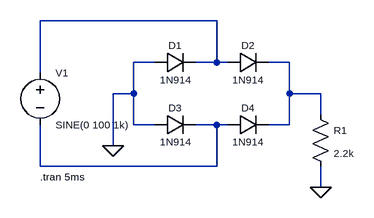
[diagram p0: schematic 1. Full Wave Rectifier.asc]
1. Full Wave Rectifier.asc, the LTspice schematic file:
Version 4
SHEET 1 880 680
WIRE 192 96 -80 96
WIRE 96 160 64 160
WIRE 192 160 192 96
WIRE 192 160 160 160
WIRE 208 160 192 160
WIRE 304 160 272 160
WIRE -80 176 -80 96
WIRE 64 208 64 160
WIRE 64 208 32 208
WIRE 304 208 304 160
WIRE 352 208 304 208
WIRE 352 240 352 208
WIRE 64 256 64 208
WIRE 96 256 64 256
WIRE 192 256 160 256
WIRE 208 256 192 256
WIRE 304 256 304 208
WIRE 304 256 272 256
WIRE 32 288 32 208
WIRE -80 320 -80 256
WIRE 192 320 192 256
WIRE 192 320 -80 320
WIRE 352 352 352 320
FLAG 32 288 0
FLAG 352 352 0
SYMBOL diode 96 176 R270
WINDOW 0 32 32 VTop 1
WINDOW 3 0 32 VBottom 1
SYMATTR InstName D1
SYMATTR Value 1N914
SYMBOL diode 208 176 R270
WINDOW 0 32 32 VTop 1
WINDOW 3 0 32 VBottom 1
SYMATTR InstName D2
SYMATTR Value 1N914
SYMBOL diode 96 272 R270
WINDOW 0 32 32 VTop 1
WINDOW 3 0 32 VBottom 1
SYMATTR InstName D3
SYMATTR Value 1N914
SYMBOL diode 208 272 R270
WINDOW 0 32 32 VTop 1
WINDOW 3 0 32 VBottom 1
SYMATTR InstName D4
SYMATTR Value 1N914
SYMBOL voltage -80 160 R0
WINDOW 0 24 16 Left 1
WINDOW 3 24 96 Left 1
WINDOW 123 0 0 Left 0
WINDOW 39 0 0 Left 0
SYMATTR InstName V1
SYMATTR Value SINE(0 100 1k)
SYMBOL res 336 224 R0
WINDOW 0 36 40 Left 1
WINDOW 3 36 76 Left 1
SYMATTR InstName R1
SYMATTR Value 2.2k
TEXT -80 336 Left 1 !.tran 5ms

The netlist it stands for:
* 1. Full Wave Rectifier.asc
D1 0 N001 1N914
D2 N001 N002 1N914
D3 0 N003 1N914
D4 N003 N002 1N914
V1 N001 N003 SINE(0 100 1k)
R1 N002 0 2.2k
.model D D
.lib standard.dio
.tran 5ms
.backanno
.end